# EAGLE design test_board_attiny84 (EAGLE 9.5.2)
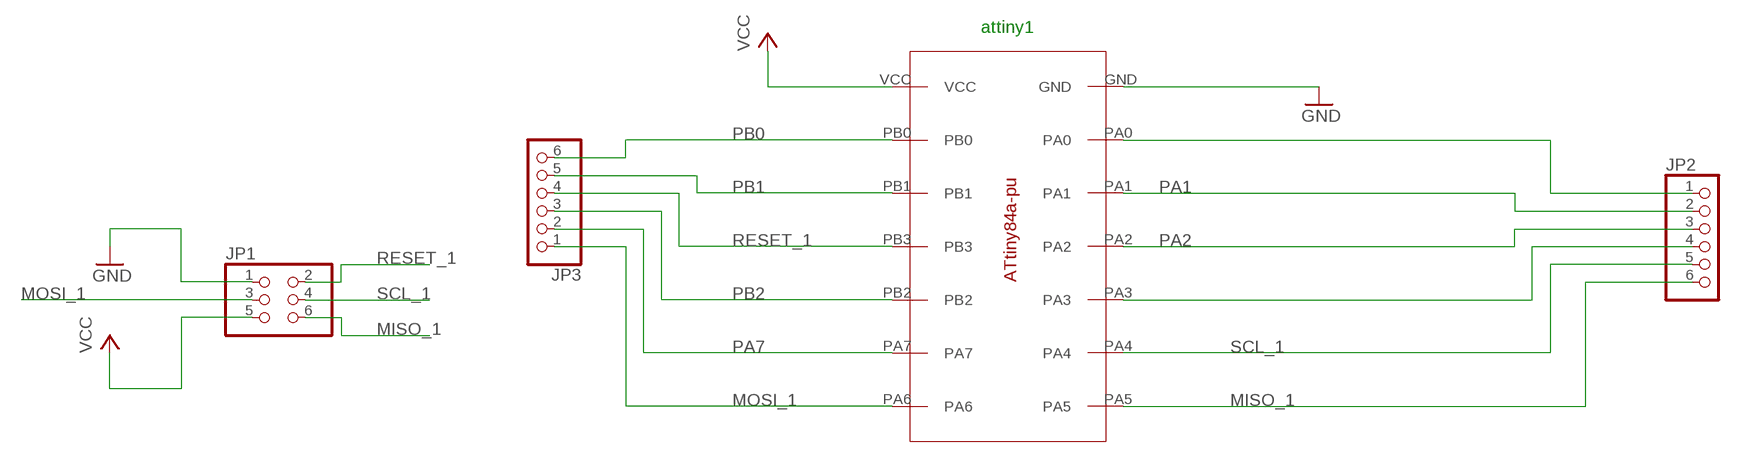
[diagram p0: schematic, sheet 1]

## Parts
JP1  PINHD-2X3  [2X03]
JP2  PINHD-1X6  [1X06]
JP3  PINHD-1X6  [1X06]
U$8  ATTINY84A-PU  [ATTINY84A-PU]

## Nets
GND: JP1.1 U$8.GND
MISO_1: JP1.6 JP2.6 U$8.PA5
MOSI_1: JP1.3 JP3.1 U$8.PA6
N$1: JP2.1 U$8.PA0
PA1: JP2.2 U$8.PA1
PA2: JP2.3 U$8.PA2
PA3: JP2.4 U$8.PA3
PA7: JP3.2 U$8.PA7
PB0: JP3.6 U$8.PB0
PB1: JP3.5 U$8.PB1
PB2: JP3.3 U$8.PB2
RESET_1: JP1.2 JP3.4 U$8.PB3
SCL_1: JP1.4 JP2.5 U$8.PA4
VCC: JP1.5 U$8.VCC

## Notes on the sheet
- attiny1

## Library data of the parts
JP1 = pinhead:PINHD-2X3: PIN HEADER
JP2 JP3 = pinhead:PINHD-1X6: PIN HEADER
U$8 = elric:ATTINY84A-PU

## Board
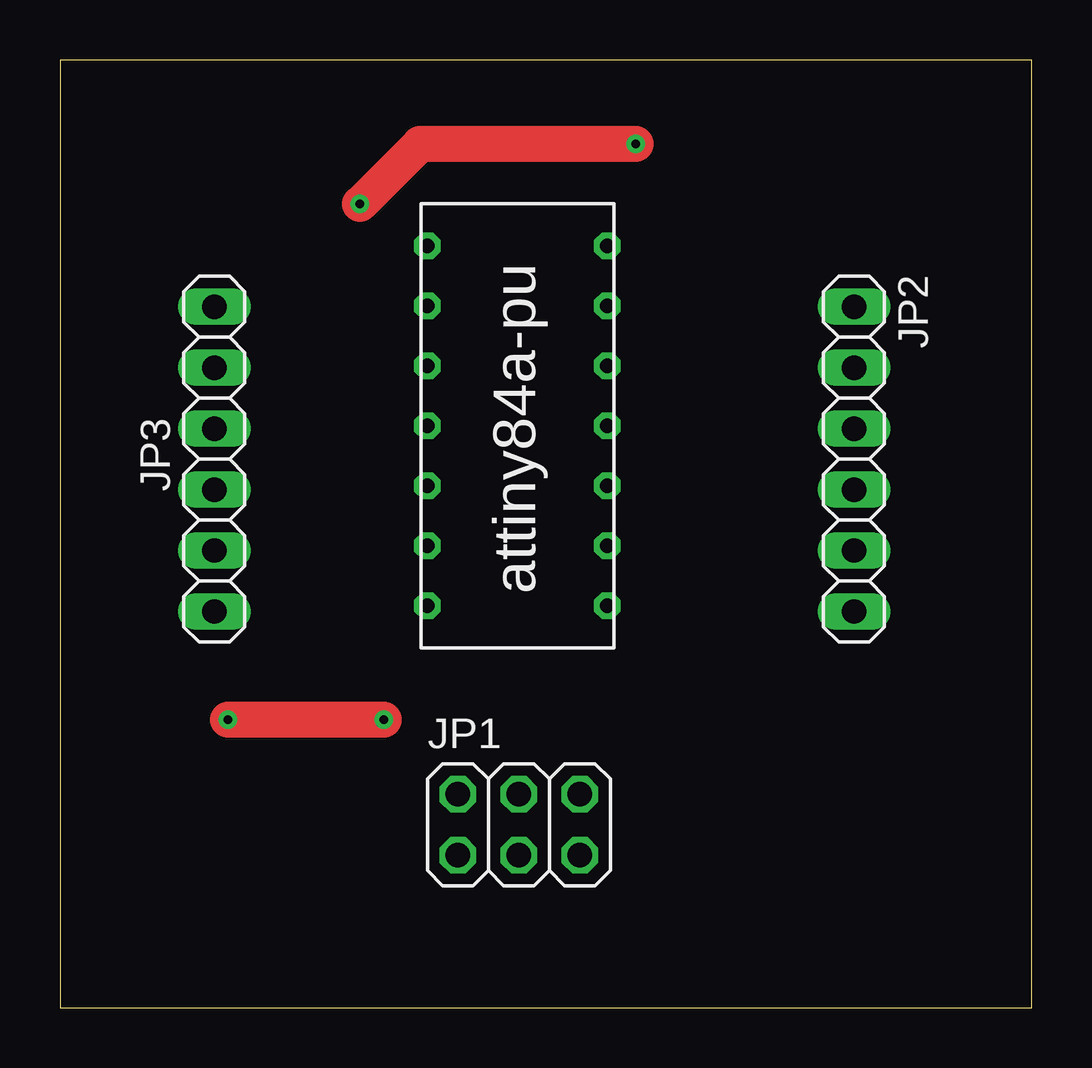
[diagram p1: board, top side]
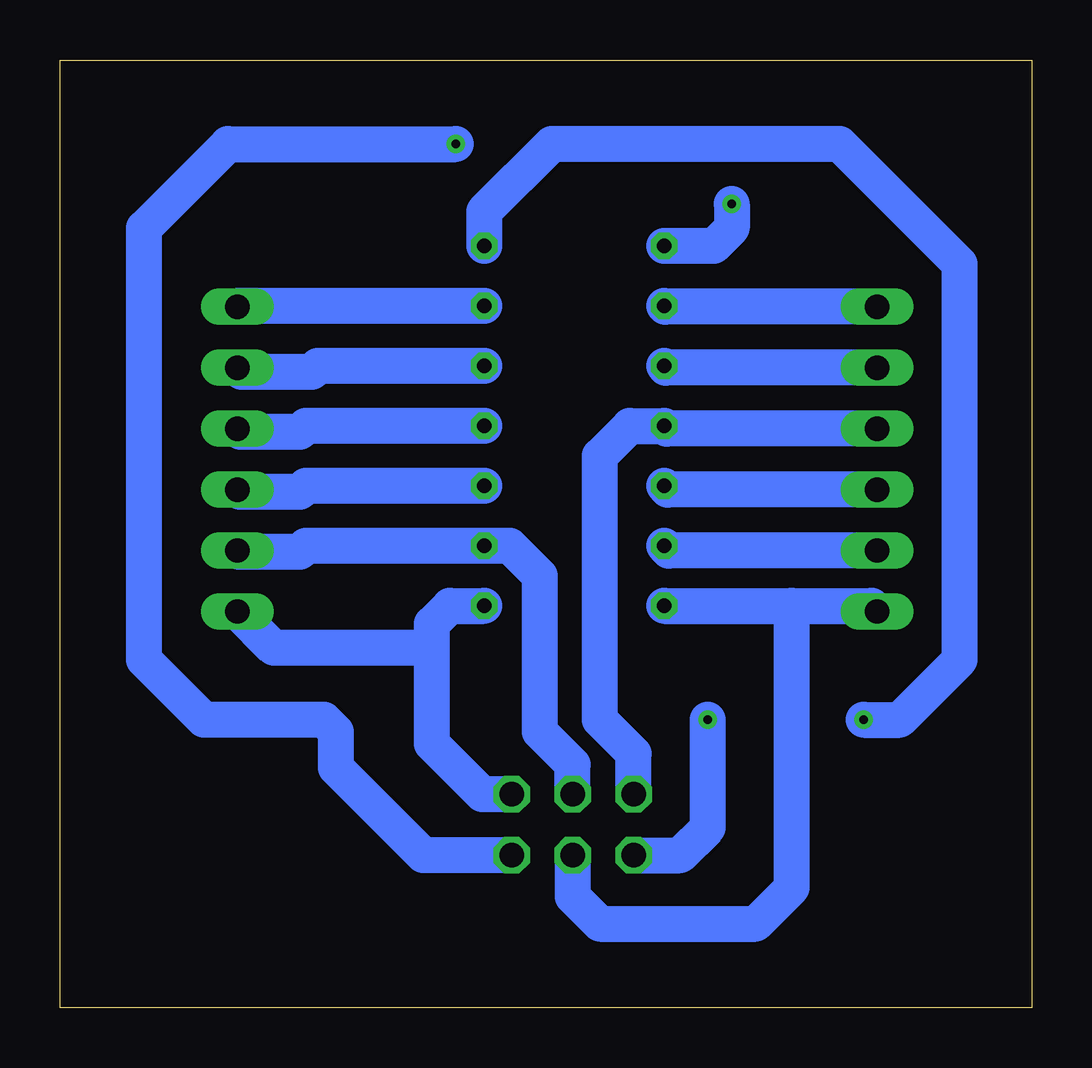
[diagram p2: board, bottom side, seen from below]

Size 40.5 x 39.5 mm. Coordinates in mm from the lower left corner, seen from the top.
Outline: 0,0 40.5,0 40.5,39.5 0,39.5 0,0
Copper layers (1*16): Top 0.035mm / dielectric 1.5mm / Bottom 0.035mm
Design rules "default": minimum track width 6mil, minimum drill 0.35mm, track to track 6mil, track to pad 6mil, pad to pad 6mil, via to via 6mil, smd to smd 6mil, copper to edge 40mil, drill to drill 6mil, minimum pad ring 10mil, minimum via ring 8mil, stop-mask expansion 4mil, vias tented up to drill 0mil, thermal gap 10mil

### Footprints (pad centres in the part's own frame; a part is rotated, then mirrored left to right if it is on the bottom)
2X03 = drill 1.016 octagon: 1 -2.54,-1.27; 2 -2.54,1.27; 3 0,-1.27; 4 0,1.27; 5 2.54,-1.27; 6 2.54,1.27
1X06 = drill 1.016 long: 1 -6.35,0; 2 -3.81,0; 3 -1.27,0; 4 1.27,0; 5 3.81,0; 6 6.35,0
ATTINY84A-PU = drill 0.6 octagon: GND 7.5,0; PA0 7.5,-2.5; PA1 7.5,-5; PA2 7.5,-7.5; PA3 7.5,-10; PA4 7.5,-12.5; PA5 7.5,-15; PA6 0,-15; PA7 0,-12.5; PB0 0,-2.5; PB1 0,-5; PB2 0,-10; PB3 0,-7.5; VCC 0,0

### Placement (x,y rotation side)
JP1  19.13,7.62 0 top
JP2  33.1,22.86 270 top
JP3  6.43,22.86 90 top
U$8  15.32,31.75 0 top

### Tracks (layer width: path | path; a pad name or v marks a point on that pad's centre or on a via)
GND  (via drill 0.35)
  Top 1.5: v13.5,12 v7,12
  Bottom 1.5: JP1.1 14.65,6.35 13.5,7.5 v13.5,12 | v7,12 5.5,12 3,14.5 3,31 8,36 20,36 22.82,33.18 U$8.GND
MISO_1
  Bottom 1.5: JP1.6 22.89,8.89 25,11 25,15 | 25,15 25,16 24.25,16.75 U$8.PA5 | 25,15 31.59,15 JP2.6
MOSI_1
  Bottom 1.5: U$8.PA6 10,16.75 | 10,16.75 6.67,16.75 JP3.1 | JP1.3 19.13,4.63 18,3.5 11.5,3.5 10,5 10,16.75
N$1
  Bottom 1.5: U$8.PA0 33.06,29.25 JP2.1
PA1
  Bottom 1.5: U$8.PA1 29.75,26.75 30,26.5 32.93,26.5 JP2.2
PA2
  Bottom 1.5: U$8.PA2 30.25,24.25 30.5,24 32.97,24 JP2.3
PA3
  Bottom 1.5: U$8.PA3 30.25,21.75 30.5,21.5 33.01,21.5 JP2.4
PA7
  Bottom 1.5: JP3.2 15.12,19.05 U$8.PA7
PB0
  Bottom 1.5: JP3.6 15.28,29.21 U$8.PB0
PB1
  Bottom 1.5: JP3.5 15.24,26.67 U$8.PB1
PB2
  Bottom 1.5: JP3.3 15.16,21.59 U$8.PB2
RESET_1
  Bottom 1.5: JP1.2 16.59,10.59 18,12 18,23 16.75,24.25 U$8.PB3 15.2,24.13 JP3.4
SCL_1
  Bottom 1.5: JP1.4 19.13,10.13 20.5,11.5 20.5,18 21.75,19.25 U$8.PA4 30.25,19.25 30.5,19 33.05,19 JP2.5
VCC  (via drill 0.35)
  Top 1.5: v12.5,33.5 15,36 v24,36
  Bottom 1.5: JP1.5 25.35,6.35 29,10 29,11.5 29.5,12 34.5,12 37,14.5 37,32.5 33.5,36 v24,36 | v12.5,33.5 12.5,32.5 13.25,31.75 U$8.VCC